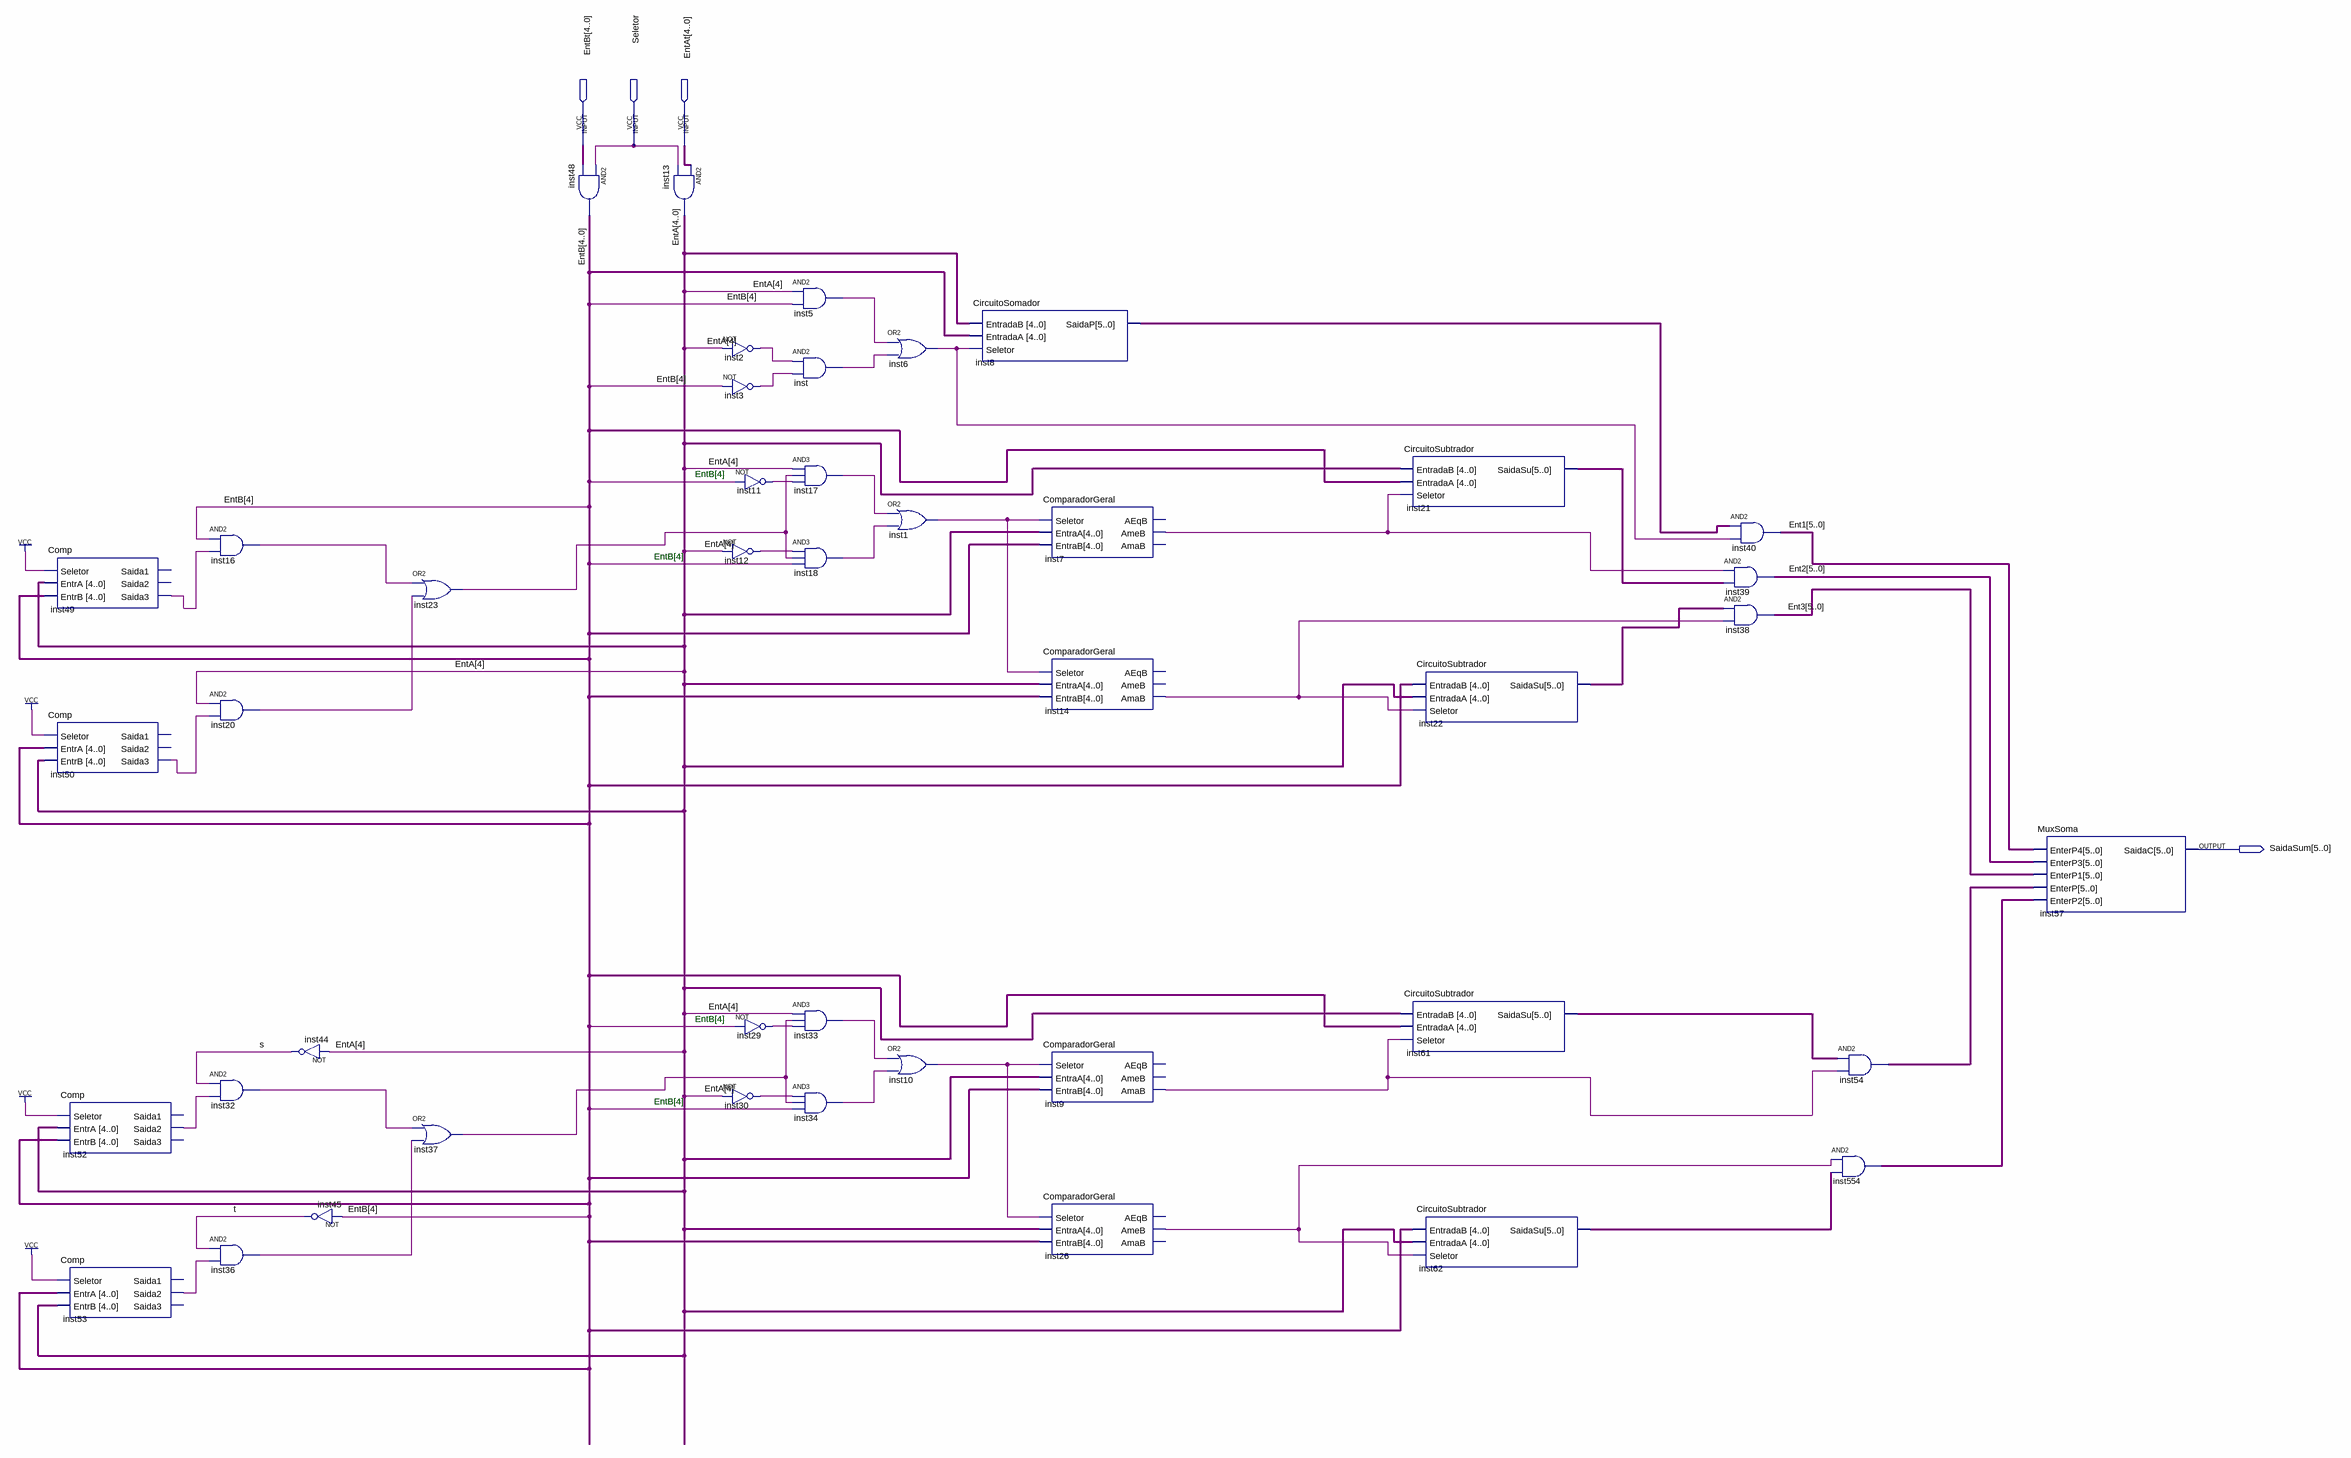
[diagram p0: schematic sheet]
// Quartus schematic CircuitoSomadorCompleto.bdf as structural Verilog: 44 symbols, 4 pins
module CircuitoSomadorCompleto (
  input  [4:0] EntBt,
  input  Seletor,
  input  [4:0] EntAt,
  output [5:0] SaidaSum
);

  wire inst1_out, inst2_out, inst3_out, inst5_out, inst6_out, inst7_ameb, inst9_amab, inst10_out, inst11_out,
       inst12_out, inst14_amab, inst16_out, inst17_out, inst18_out, inst20_out, inst23_out, inst26_ameb,
       inst29_out, inst30_out, inst32_out, inst33_out, inst34_out, inst36_out, inst37_out, inst49_saida3,
       inst50_saida3, inst52_saida2, inst53_saida2, inst_out, s, t;
  wire [4:0] EntA, EntB;
  wire [5:0] Ent1, Ent2, Ent3, inst8_saidap, inst21_saidasu, inst22_saidasu, inst54_out, inst61_saidasu,
       inst62_saidasu, inst554_out;

  Comp inst49 (.Seletor(1'b1), .EntrA(EntA), .EntrB(EntB), .Saida3(inst49_saida3));  // open: Saida1, Saida2
  Comp inst50 (.Seletor(1'b1), .EntrA(EntB), .EntrB(EntA), .Saida3(inst50_saida3));  // open: Saida1, Saida2
  Comp inst52 (.Seletor(1'b1), .EntrA(EntA), .EntrB(EntB), .Saida2(inst52_saida2));  // open: Saida1, Saida3
  Comp inst53 (.Seletor(1'b1), .EntrA(EntB), .EntrB(EntA), .Saida2(inst53_saida2));  // open: Saida1, Saida3
  and inst16 (inst16_out, EntB[4], inst49_saida3);
  and inst20 (inst20_out, EntA[4], inst50_saida3);
  and inst32 (inst32_out, s, inst52_saida2);
  and inst36 (inst36_out, t, inst53_saida2);
  not inst44 (s, EntA[4]);
  not inst45 (t, EntB[4]);
  or inst23 (inst23_out, inst16_out, inst20_out);
  or inst37 (inst37_out, inst32_out, inst36_out);
  assign EntB = {5{Seletor}} & EntBt;  // AND2 inst48, 5 bits wide
  assign EntA = EntAt & {5{Seletor}};  // AND2 inst13, 5 bits wide
  not inst2 (inst2_out, EntA[4]);
  not inst3 (inst3_out, EntB[4]);
  not inst11 (inst11_out, EntB[4]);
  not inst12 (inst12_out, EntA[4]);
  not inst29 (inst29_out, EntB[4]);
  not inst30 (inst30_out, EntA[4]);
  and inst5 (inst5_out, EntA[4], EntB[4]);
  and inst (inst_out, inst2_out, inst3_out);
  and inst17 (inst17_out, EntA[4], inst23_out, inst11_out);
  and inst18 (inst18_out, inst12_out, inst23_out, EntB[4]);
  and inst33 (inst33_out, EntA[4], inst37_out, inst29_out);
  and inst34 (inst34_out, inst30_out, inst37_out, EntB[4]);
  or inst6 (inst6_out, inst5_out, inst_out);
  or inst1 (inst1_out, inst17_out, inst18_out);
  or inst10 (inst10_out, inst33_out, inst34_out);
  CircuitoSomador inst8 (.EntradaB(EntA), .EntradaA(EntB), .Seletor(inst6_out), .SaidaP(inst8_saidap));
  ComparadorGeral inst7 (.Seletor(inst1_out), .EntraA(EntA), .EntraB(EntB), .AmeB(inst7_ameb));  // open: AEqB, AmaB
  ComparadorGeral inst14 (.Seletor(inst1_out), .EntraA(EntA), .EntraB(EntB), .AmaB(inst14_amab));  // open: AEqB, AmeB
  ComparadorGeral inst9 (.Seletor(inst10_out), .EntraA(EntA), .EntraB(EntB), .AmaB(inst9_amab));  // open: AEqB, AmeB
  ComparadorGeral inst26 (.Seletor(inst10_out), .EntraA(EntA), .EntraB(EntB), .AmeB(inst26_ameb));  // open: AEqB, AmaB
  CircuitoSubtrador inst21 (.EntradaB(EntA), .EntradaA(EntB), .Seletor(inst7_ameb), .SaidaSu(inst21_saidasu));
  CircuitoSubtrador inst61 (.EntradaB(EntA), .EntradaA(EntB), .Seletor(inst9_amab), .SaidaSu(inst61_saidasu));
  CircuitoSubtrador inst22 (.EntradaB(EntB), .EntradaA(EntA), .Seletor(inst14_amab), .SaidaSu(inst22_saidasu));
  CircuitoSubtrador inst62 (.EntradaB(EntB), .EntradaA(EntA), .Seletor(inst26_ameb), .SaidaSu(inst62_saidasu));
  assign Ent1 = inst8_saidap & {6{inst6_out}};  // AND2 inst40, 6 bits wide
  assign Ent2 = {6{inst7_ameb}} & inst21_saidasu;  // AND2 inst39, 6 bits wide
  assign Ent3 = inst22_saidasu & {6{inst14_amab}};  // AND2 inst38, 6 bits wide
  assign inst54_out = inst61_saidasu & {6{inst9_amab}};  // AND2 inst54, 6 bits wide
  assign inst554_out = {6{inst26_ameb}} & inst62_saidasu;  // AND2 inst554, 6 bits wide
  MuxSoma inst57 (
    .EnterP4(Ent1), .EnterP3(Ent2), .EnterP1(Ent3), .EnterP(inst54_out), .EnterP2(inst554_out),
    .SaidaC(SaidaSum));

  // Notes on the sheet:
  //   EntB[4]
  //   EntB[4]
  //   EntB[4]
  //   EntB[4]
endmodule
